# Altium schematic sheet 5_power.SchDoc: Teseu - Alimentação
size A4; DocumentNumber: 6; Revision: 0.1; SheetNumber: 6; SheetTotal: 6
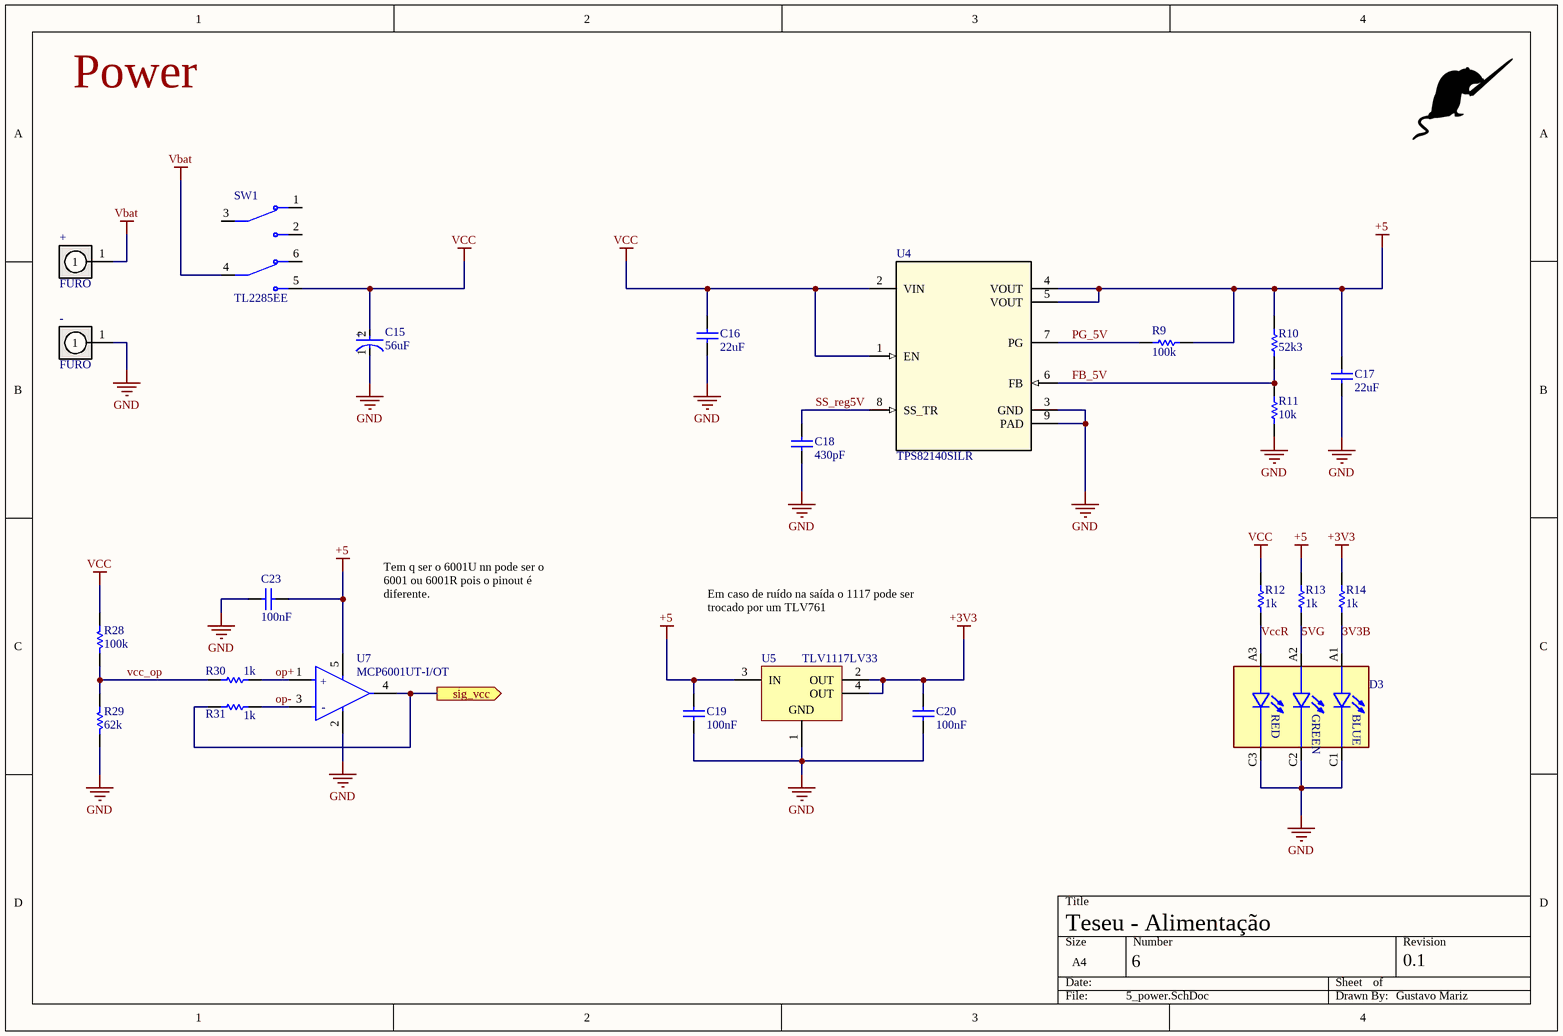
[diagram p0: 5_power.SchDoc]

## Parts
+  FURO  [FURO_2,5MM]
-  FURO  [FURO_2,5MM]
C15  56uF  [FP-PSG-F05-MFG]
C16  Valor: 22uF  [CAP 0805]  (hidden comment: CAP)
C17  Valor: 22uF  [CAP 0805]  (hidden comment: CAP)
C18  Valor: 430pF  [0603]  (hidden comment: CAP)
C19  Valor: 100nF  [0603]  (hidden comment: CAP)
C20  Valor: 100nF  [0603]  (hidden comment: CAP)
C23  Valor: 100nF  [0603]  (hidden comment: CAP)
D3  KRTBLSLPS1.32-VUVX-EQ+BTBV-D8+TWTZ-L1-B  [LED_KRTBLSLPS1.32-VUVX-EQ+BTBV-D8+TWTZ-L1-B]  (value not drawn)
R9  value 100k  [RES 0603]  (hidden comment: RESISTOR)
R10  value 52k3  [RES 0603]  (hidden comment: RESISTOR)
R11  value 10k  [RES 0603]  (hidden comment: RESISTOR)
R12  value 1k  [RES 0603]  (hidden comment: RESISTOR)
R13  value 1k  [RES 0603]  (hidden comment: RESISTOR)
R14  value 1k  [RES 0603]  (hidden comment: RESISTOR)
R28  value 100k  [RES 0603]  (hidden comment: RESISTOR)
R29  value 62k  [RES 0603]  (hidden comment: RESISTOR)
R30  value 1k  [RES 0603]  (hidden comment: RESISTOR)
R31  value 1k  [RES 0603]  (hidden comment: RESISTOR)
SW1  TL2285EE  [SW_TL2285EE]
U4  TPS82140SILR  [SIL0008D_SMD]
U5  TLV1117LV33  [DCY0004A_N]
U7  MCP6001UT-I/OT  [FP-C04-091-OT-IPC_C]

## Ports
sig_vcc (out, see 1_micro[2B])

## Nets
+3V3: C20.2 R14.2 U5.2(OUT) U5.4(OUT)
+5: C17.2 C19.2 C23.2 R9.1 R10.2 R13.2 U4.4(VOUT) U4.5(VOUT) U5.3(IN) U7.5(VDD)
GND: -.1 C15.1(C) C16.1 C17.1 C18.1 C19.1 C20.1 C23.1 D3.C1(CATHODE_BLUE) D3.C2(CATHODE_TRUE_GREEN) D3.C3(CATHODE_RED) R11.1 R29.1 U4.3(GND) U4.9(PAD) U5.1(GND) U7.2(VSS)
Vbat: +.1 SW1.4(COM2)
VCC: C15.2(A) C16.2 R12.2 R28.2 SW1.5(NO2) U4.1(EN) U4.2(VIN)
3V3B: D3.A1(ANODE_BLUE) R14.1
5VG: D3.A2(ANODE_TRUE_GREEN) R13.1
FB_5V: R10.1 R11.2 U4.6(FB)
op+: R30.2 U7.1(VIN+)
op-: R31.2 U7.3(VIN-)
PG_5V: R9.2 U4.7(PG)
sig_vcc: R31.1 U7.4(VOUT) ; port sig_vcc
SS_reg5V: C18.2 U4.8(SS_TR)
vcc_op: R28.1 R29.2 R30.1
VccR: D3.A3(ANODE_RED) R12.1

Not connected (* = marked no-connect by the designer): SW1 1(NC1) 2(NO1) 3(COM1) 6(NC2)

## Notes on the sheet
- Power
- (near U7) Tem q ser o 6001U nn pode ser o 6001 ou 6001R pois o pinout é diferente.
- (near U5) Em caso de ruído na saída o 1117 pode ser trocado por um TLV761
- Gustavo Mariz
- (in symbol CMP-0187-00471-3) +; -
- (in symbol CMP-33769-000002-1) +
- (in symbol KRTBLSLPS1.32-VUVX-EQ+BTBV-D8+TWTZ-L1-B) RED; GREEN; BLUE

## Library data of the parts
+ - = FURO NA PLACA: Criado por: Luigi Eduardo; Pertence a: Trincabotz CEFET-MG; Criado em: 26/06/2012
C15 = CMP-33769-000002-1: CAP ALUM POLY 56UF 20% 25V T/H / APSG250ELL560MF05S / https://www.mouser.com/ProductDetail/Chemi-Con/APSG250ELL560MF05S?qs=nxZbHzLpdvcfhTNzSmDv4w%3D%3D; Manufacturer: United Chemi-Con; Leakage Current: 500uA; Dissipation Factor: 12%; Life: 15000Hours; Ripple Current: 2600mA; Esr: 30mΩ; Material: Polymer; Category: Cap; Temperature Range High: +105°C; Capacitance: 56uF; Temperature: -55°C to +105°C; Octopart: https://octopart.com/apsg250ell560mf05s-united+chemi-con-70515924; ComponentLink2URL: http://www.chemi-con.co.jp/cgi-bin/CAT_DB/SEARCH/cat_db_al.cgi?e=e&j=p&pdfname=psg; Automotive: No; Temperature Range Low: -55°C; Device Class L1: Passive Components; Value: 56uF; Device Class L2: Capacitors; RoHS: TRUE; Digikey Description: CAP ALUM POLY 56UF 20% 25V T/H; Device Class L3: Polymer Capacitors; Height: 6mm; Tolerance: 20%; Package: PSG-F05; ComponentLink2Description: Datasheet; Manufacturer Part Number: APSG250ELL560MF05S; Voltage Rating: 25V; Lead Free: Yes
C16-C20 C23 = CAP. CERÂMICO: Capacitor; Criador por: Luigi Eduardo; Pertence a: Trincabotz; Criado em: 26/06/2012
D3 = KRTBLSLPS1.32-VUVX-EQ+BTBV-D8+TWTZ-L1-B: Red, Green, Blue (RGB) 621nm Red, 532nm Green, 467nm Blue LED Indication - Discrete 2.05V Red, 2.65V Green, 2.85V Blue 6-SMD, J-Lead; MF: OSRAM Opto Semiconductors Inc.; Check_prices: https://www.snapeda.com/parts/KRTBLSLPS1.32-VUVX-EQ+BTBV-D8+TWTZ-L1-B/OSRAM+Opto+Semiconductors+Inc./view-part/?ref=eda; SnapEDA_Link: https://www.snapeda.com/parts/KRTBLSLPS1.32-VUVX-EQ+BTBV-D8+TWTZ-L1-B/OSRAM+Opto+Semiconductors+Inc./view-part/?ref=snap; Value: *; Purchase-URL: https://pricing.snapeda.com/search/part/KRTBLSLPS1.32-VUVX-EQ+BTBV-D8+TWTZ-L1-B/?ref=eda; Availability: In Stock; Price: None; MP: KRTBLSLPS1.32-VUVX-EQ+BTBV-D8+TWTZ-L1-B; Package: SMD-6 OSRAM Opto Semiconductors Inc.
U4 = TPS82140SILR: No Description Available; Mfr_Name: Texas Instruments; TYPE: TYPE; RefDes: RefDes
U5 = CMP-0395-00503-2: Single Output LDO, 1 A, Fixed 3.3 V Output, 2 to 5.5 V Input, 4-pin SOT-223 (DCY), -40 to 125 degC, Green (RoHS & no Sb/Br); Manufacturer: Texas Instruments; PartNumber: TLV1117LV33DCYR; Vout Adj(Min)(V): 3.3; Vdo(Typ)(mV): 1200; Iq(Typ)(mA): 0.05; Accuracy(%): 2; Iout(Max)(A): 1; SubFamily: Single Channel LDO; Vin(Max)(V): 5.5; PackageReference: DCY0004A; PackageDescription: 4-Pin Plastic Small Outline, Body 3.5 x 6.5 mm, Pitch 2.3 mm; Vout Adj(Max)(V): 3.3; Mounting Technology: Surface Mount; ComponentLink2Description: Datasheet; ComponentLink1Description: Manufacturer URL; ComponentLink3Description: Package Specification; ComponentLink1URL: http://www.ti.com/; ComponentLink2URL: http://www.ti.com/general/docs/lit/getliterature.tsp?genericPartNumber=TLV1117LV33&fileType=pdf; Fixed Output Options(V): 3.3; PackageVersion: 4202506/B; Vin(Min)(V): 2; DatasheetVersion: SBVS160A; Eco-Plan: Green (RoHS & no Sb/Br); ComponentLink3URL: http://www.ti.com/litv/pdf/mpds094a; Code_JEDEC: TO-261
U7 = CMP-0187-00471-3: IC OPAMP GP 1 CIRCUIT SOT23-5; Nominal Supply Current: 100uA; Unity Gain Bandwidth Product: 1MHz; Voltage Gain: 112dB; Power Supply Rejection Ratio (PSRR): 86dB; Slew Rate: 0.6V/µs; Input Offset Voltage (Vos): 4.5mV; Number of Elements: 1; Min Supply Voltage: 1.8V; Common Mode Rejection Ratio: 60dB; Operating Supply Voltage: 5.5V; Max Frequency: 1kHz; Input Bias Current: 1pA; Max Supply Voltage: 6V; Output Current: 23mA; Width: 1.8mm; Packaging: Tape and Reel; Number of Pins: 5; Height: 1.3mm; Mount: Surface Mount; Lead Free: Lead Free; Bandwidth: 1MHz; Number of Channels: 1; REACH SVHC: No SVHC; Case/Package: SOT-23; Number of Amplifiers: 1; Gain Bandwidth Product: 1MHz; Radiation Hardening: No; Package Quantity: 3000; Length: 3.1mm; Min Operating Temperature: -40°C; Max Operating Temperature: 85°C; Number of Circuits: 1
SW1 = TL2285EE: Value: *; Package: None; Price: None; MP: TL2285EE; Availability: Unavailable